# EasyEDA Pro project ProPrj_ch32v305_pico.epro, board 40low_CH32V305_RightWing
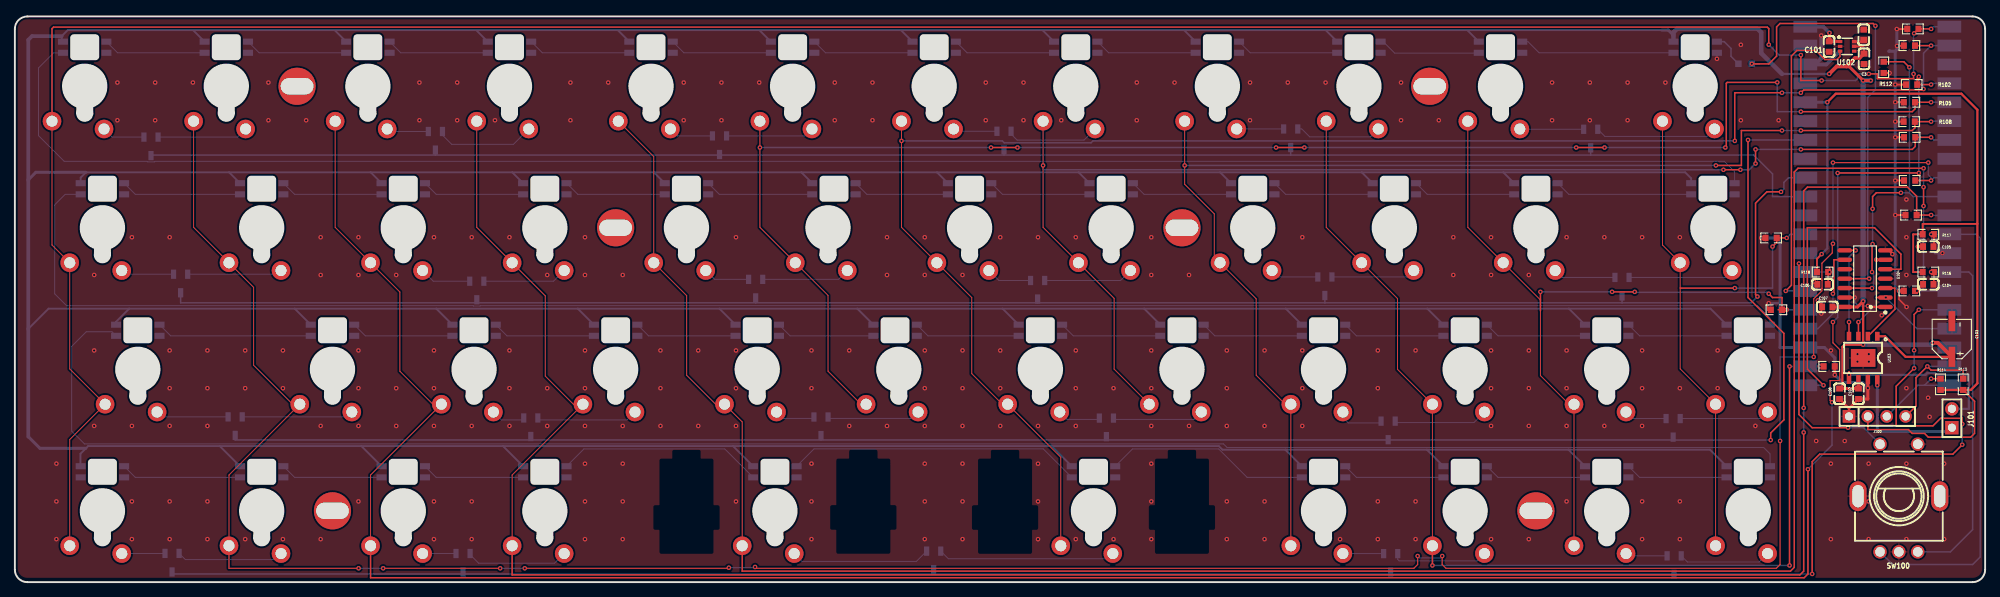
[diagram p5: board, top side]
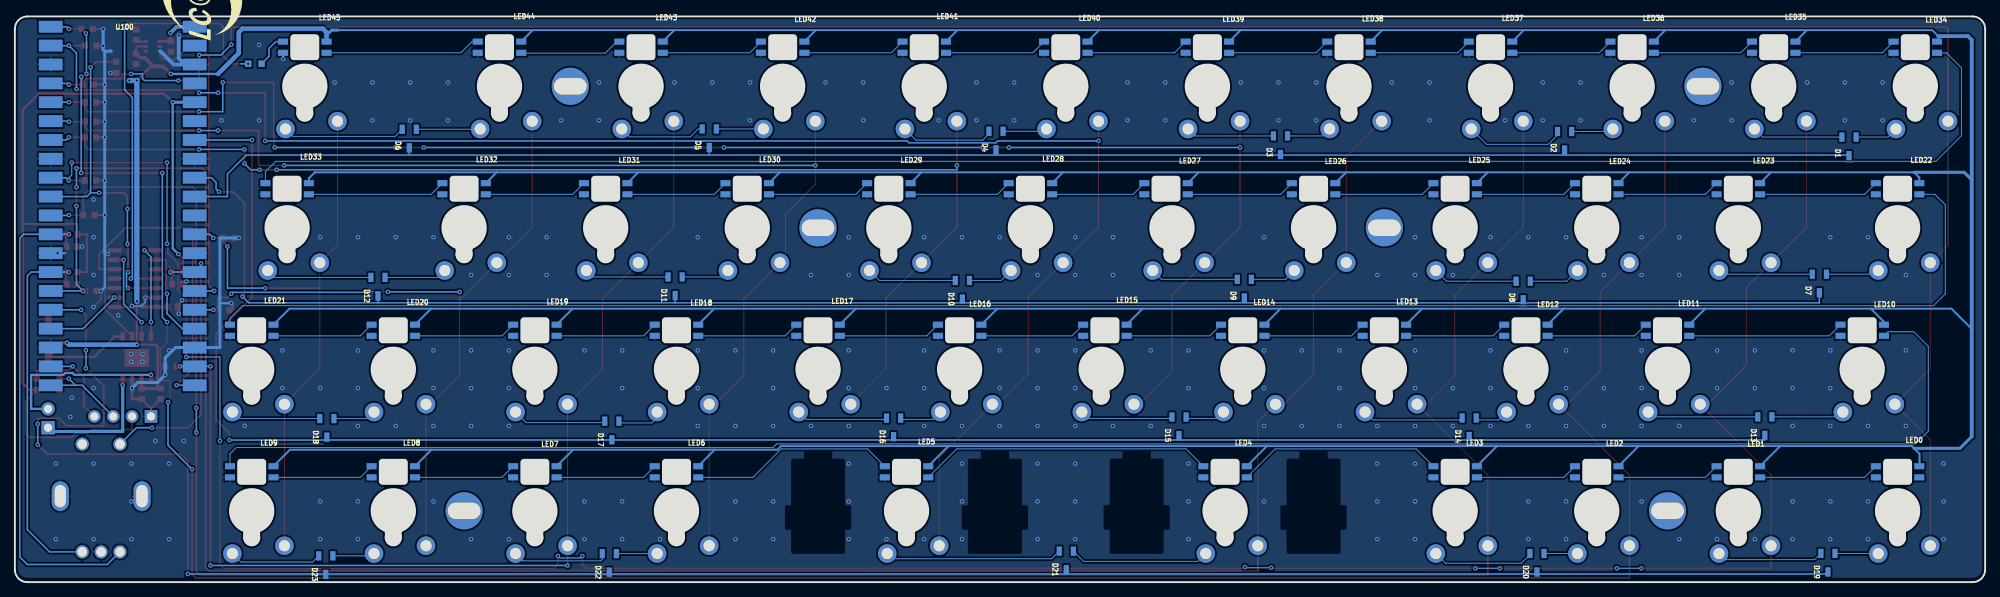
[diagram p6: board, bottom side, seen from below]

Outline 265.1 x 76.15 mm; copper layers: Top Layer, Bottom Layer. Coordinates in mm from the lower left corner of the outline.
Outline path: 0,74.47 0,1.68 arc(0.49,0.49) 1.68,0 263.43,0 arc(264.61,0.49) 265.1,1.68 265.1,74.47 arc(264.61,75.66) 263.43,76.15 1.68,76.15 arc(0.49,75.66) 0,74.47
Stack: Top Layer 0.035mm / Dielectric1 1.51mm FR4 er 4.5 / Bottom Layer 0.035mm

## Design rules (mm)
spacing Default (default): track to track 0.102, other pairs 0 to 0.3
track width Default (default): min 0.127, default 0.127, max 25.4
track width power: min 0.127, default 0.254, max 2.54
differential pair differentialPair (default): width min 0.127, default 2.54, max 2.54; gap min 0.127, default 0.152
net GND uses copperRegion
net VCC uses copperRegion, power
net 3V3 uses power
net VBUS_RAW uses power

## Placement (name value [footprint] x y rotation side)
C3  470nF  [C0603]  248.81 70.44 270 top
C100  100nF  [C0603]  248.77 73.68 90 top
C101  1uF  [C0603]  244.11 72.09 90 top
C102  100nF  [C0603]  248.06 25.36 270 top
C103  100uF  [CAP-SMD_BD5.0-L5.3-W5.3-LS6.3-FD]  260.63 32.72 90 top
C104  10nF  [C0603]  257.45 40.09 0 top
C105  10nF  [C0603]  257.45 45.17 0 top
C106  10nF  [C0603]  243.23 40.09 0 top
C107  100nF  [C0603]  243.87 37.04 180 top
C108  1uF  [C0603]  245.52 25.36 270 top
D1  BAT54A,215  [SOT-23-3]  18.32 58.66 90 bottom
D2  BAT54A,215  [SOT-23-3]  56.58 59.41 90 bottom
D3  BAT54A,215  [SOT-23-3]  94.81 58.82 90 bottom
D4  BAT54A,215  [SOT-23-3]  133.09 59.44 90 bottom
D5  BAT54A,215  [SOT-23-3]  171.67 59.75 90 bottom
D6  BAT54A,215  [SOT-23-3]  212.03 59.71 90 bottom
D7  BAT54A,215  [SOT-23-3]  22.3 40.2 90 bottom
D8  BAT54A,215  [SOT-23-3]  62.16 39.26 90 bottom
D9  BAT54A,215  [SOT-23-3]  99.67 39.51 90 bottom
D10  BAT54A,215  [SOT-23-3]  137.62 39.36 90 bottom
D11  BAT54A,215  [SOT-23-3]  176.26 39.83 90 bottom
D12  BAT54A,215  [SOT-23-3]  216.25 39.77 90 bottom
D13  BAT54A,215  [SOT-23-3]  29.64 21 90 bottom
D14  BAT54A,215  [SOT-23-3]  69.42 20.85 90 bottom
D15  BAT54A,215  [SOT-23-3]  108.47 20.98 90 bottom
D16  BAT54A,215  [SOT-23-3]  146.87 20.83 90 bottom
D17  BAT54A,215  [SOT-23-3]  184.78 20.42 90 bottom
D18  BAT54A,215  [SOT-23-3]  223.12 20.77 90 bottom
D19  BAT54A,215  [SOT-23-3]  21.15 2.62 90 bottom
D20  BAT54A,215  [SOT-23-3]  60.3 2.61 90 bottom
D21  BAT54A,215  [SOT-23-3]  123.63 2.93 90 bottom
D22  BAT54A,215  [SOT-23-3]  185.12 2.59 90 bottom
D23  BAT54A,215  [SOT-23-3]  223.26 2.29 90 bottom
J100  B-2100S04P-A110  [HDR-TH_4P-P2.54-V-M]  250.6 22.31 0 top
J101  SPEAKER 8R  [HDR-TH_2P-P2.54-V-M-1]  260.63 22.06 90 top
LED0  SK6812MINI-E-012  [reverse-led-candidate]  11.78 14.85 0 bottom
LED1  SK6812MINI-E-012  [reverse-led-candidate]  33.21 14.85 0 bottom
LED2  SK6812MINI-E-012  [reverse-led-candidate]  52.26 14.85 0 bottom
LED3  SK6812MINI-E-012  [reverse-led-candidate]  71.31 14.85 0 bottom
LED4  SK6812MINI-E-012  [reverse-led-candidate]  102.27 14.85 0 bottom
LED5  SK6812MINI-E-012  [reverse-led-candidate]  145.13 14.85 0 bottom
LED6  SK6812MINI-E-012  [reverse-led-candidate]  176.09 14.85 0 bottom
LED7  SK6812MINI-E-012  [reverse-led-candidate]  195.14 14.85 0 bottom
LED8  SK6812MINI-E-012  [reverse-led-candidate]  214.19 14.85 0 bottom
LED9  SK6812MINI-E-012  [reverse-led-candidate]  233.24 14.85 0 bottom
LED10  SK6812MINI-E-012  [reverse-led-candidate]  16.54 33.9 0 bottom
LED11  SK6812MINI-E-012  [reverse-led-candidate]  42.74 33.9 0 bottom
LED12  SK6812MINI-E-012  [reverse-led-candidate]  61.79 33.9 0 bottom
LED13  SK6812MINI-E-012  [reverse-led-candidate]  80.84 33.9 0 bottom
LED14  SK6812MINI-E-012  [reverse-led-candidate]  99.89 33.9 0 bottom
LED15  SK6812MINI-E-012  [reverse-led-candidate]  118.44 33.9 0 bottom
LED16  SK6812MINI-E-012  [reverse-led-candidate]  137.99 33.9 0 bottom
LED17  SK6812MINI-E-012  [reverse-led-candidate]  157.04 33.9 0 bottom
LED18  SK6812MINI-E-012  [reverse-led-candidate]  176.09 33.9 0 bottom
LED19  SK6812MINI-E-012  [reverse-led-candidate]  195.14 33.9 0 bottom
LED20  SK6812MINI-E-012  [reverse-led-candidate]  214.19 33.9 0 bottom
LED21  SK6812MINI-E-012  [reverse-led-candidate]  233.24 33.9 0 bottom
LED22  SK6812MINI-E-012  [reverse-led-candidate]  11.78 52.95 0 bottom
LED23  SK6812MINI-E-012  [reverse-led-candidate]  33.21 52.95 0 bottom
LED24  SK6812MINI-E-012  [reverse-led-candidate]  52.26 52.95 0 bottom
LED25  SK6812MINI-E-012  [reverse-led-candidate]  71.31 52.95 0 bottom
LED26  SK6812MINI-E-012  [reverse-led-candidate]  90.36 52.95 0 bottom
LED27  SK6812MINI-E-012  [reverse-led-candidate]  110.21 52.95 0 bottom
LED28  SK6812MINI-E-012  [reverse-led-candidate]  128.46 52.95 0 bottom
LED29  SK6812MINI-E-012  [reverse-led-candidate]  147.51 52.95 0 bottom
LED30  SK6812MINI-E-012  [reverse-led-candidate]  166.56 52.95 0 bottom
LED31  SK6812MINI-E-012  [reverse-led-candidate]  185.61 52.95 0 bottom
LED32  SK6812MINI-E-012  [reverse-led-candidate]  204.66 52.95 0 bottom
LED33  SK6812MINI-E-012  [reverse-led-candidate]  228.47 52.95 0 bottom
LED34  SK6812MINI-E-012  [reverse-led-candidate]  9.4 72 0 bottom
LED35  SK6812MINI-E-012  [reverse-led-candidate]  28.45 72 0 bottom
LED36  SK6812MINI-E-012  [reverse-led-candidate]  47.5 72 0 bottom
LED37  SK6812MINI-E-012  [reverse-led-candidate]  66.55 72 0 bottom
LED38  SK6812MINI-E-012  [reverse-led-candidate]  85.6 72 0 bottom
LED39  SK6812MINI-E-012  [reverse-led-candidate]  104.65 72 0 bottom
LED40  SK6812MINI-E-012  [reverse-led-candidate]  123.7 72 0 bottom
LED41  SK6812MINI-E-012  [reverse-led-candidate]  142.75 72 0 bottom
LED42  SK6812MINI-E-012  [reverse-led-candidate]  161.8 72 0 bottom
LED43  SK6812MINI-E-012  [reverse-led-candidate]  180.85 72 0 bottom
LED44  SK6812MINI-E-012  [reverse-led-candidate]  199.9 72 0 bottom
LED45  SK6812MINI-E-012  [reverse-led-candidate]  226.09 72 0 bottom
NOREF  -  [Pad_e1]  42.74 9.6 0 top
NOREF#2  -  [Pad_e4]  37.97 66.75 0 top
NOREF#3  -  [Pad_e5]  157.04 47.7 0 top
NOREF#4  -  [Pad_e3]  204.66 9.6 0 top
NOREF#5  -  [Pad_e2]  80.84 47.7 0 top
NOREF#6  -  [Pad_e6]  190.37 66.75 0 top
R100  10kΩ  [R0603]  255.38 74.47 180 top
R101  10kΩ  [R0603]  254.95 54.06 180 top
R102  10kΩ  [R0603]  255.22 66.98 180 top
R103  10kΩ  [R0603]  255.14 49.41 180 top
R104  10kΩ  [R0603]  254.91 39.2 180 top
R105  10kΩ  [R0603]  254.91 64.6 180 top
R106  10kΩ  [R0603]  254.91 72.22 180 top
R107  10kΩ  [R0603]  254.95 59.88 180 top
R108  10kΩ  [R0603]  254.89 61.99 180 top
R109  10kΩ  [R0603]  244.12 29.04 0 top
R110  10kΩ  [R0603]  237.02 36.66 180 top
R111  10kΩ  [R0603]  236.31 46.33 180 top
R112  10kΩ  [R0603]  251.46 69.29 270 top
R113  33R  [0603]  232.81 69.78 180 bottom
R114  4.7kΩ  [R0603]  259.11 26.63 270 top
R115  4.7kΩ  [R0603]  262.15 26.63 270 top
R116  10kΩ  [R0603]  257.45 41.74 0 top
R117  10kΩ  [R0603]  257.45 46.82 180 top
R118  10kΩ  [R0603]  243.23 41.74 180 top
S1  Gateron KS-33  [40low_KS33_Solder_KeepCentre6p1]  9.4 66.75 0 top
S2  Gateron KS-33  [40low_KS33_Solder_KeepCentre6p1]  28.45 66.75 0 top
S3  Gateron KS-33  [40low_KS33_Solder_KeepCentre6p1]  47.5 66.75 0 top
S4  Gateron KS-33  [40low_KS33_Solder_KeepCentre6p1]  66.55 66.75 0 top
S5  Gateron KS-33  [40low_KS33_Solder_KeepCentre6p1]  85.6 66.75 0 top
S6  Gateron KS-33  [40low_KS33_Solder_KeepCentre6p1]  104.65 66.75 0 top
S7  Gateron KS-33  [40low_KS33_Solder_KeepCentre6p1]  123.7 66.75 0 top
S8  Gateron KS-33  [40low_KS33_Solder_KeepCentre6p1]  142.75 66.75 0 top
S9  Gateron KS-33  [40low_KS33_Solder_KeepCentre6p1]  161.8 66.75 0 top
S10  Gateron KS-33  [40low_KS33_Solder_KeepCentre6p1]  180.85 66.75 0 top
S11  Gateron KS-33  [40low_KS33_Solder_KeepCentre6p1]  199.9 66.75 0 top
S12  Gateron KS-33  [40low_KS33_Solder_KeepCentre6p1]  226.09 66.75 0 top
S13  Gateron KS-33  [40low_KS33_Solder_KeepCentre6p1]  11.78 47.7 0 top
S14  Gateron KS-33  [40low_KS33_Solder_KeepCentre6p1]  33.21 47.7 0 top
S15  Gateron KS-33  [40low_KS33_Solder_KeepCentre6p1]  52.26 47.7 0 top
S16  Gateron KS-33  [40low_KS33_Solder_KeepCentre6p1]  71.31 47.7 0 top
S17  Gateron KS-33  [40low_KS33_Solder_KeepCentre6p1]  90.36 47.7 0 top
S18  Gateron KS-33  [40low_KS33_Solder_KeepCentre6p1]  109.41 47.7 0 top
S19  Gateron KS-33  [40low_KS33_Solder_KeepCentre6p1]  128.46 47.7 0 top
S20  Gateron KS-33  [40low_KS33_Solder_KeepCentre6p1]  147.51 47.7 0 top
S21  Gateron KS-33  [40low_KS33_Solder_KeepCentre6p1]  166.56 47.7 0 top
S22  Gateron KS-33  [40low_KS33_Solder_KeepCentre6p1]  185.61 47.7 0 top
S23  Gateron KS-33  [40low_KS33_Solder_KeepCentre6p1]  204.66 47.7 0 top
S24  Gateron KS-33  [40low_KS33_Solder_KeepCentre6p1]  228.47 47.7 0 top
S25  Gateron KS-33  [40low_KS33_Solder_KeepCentre6p1]  16.54 28.65 0 top
S26  Gateron KS-33  [40low_KS33_Solder_KeepCentre6p1]  42.74 28.65 0 top
S27  Gateron KS-33  [40low_KS33_Solder_KeepCentre6p1]  61.79 28.65 0 top
S28  Gateron KS-33  [40low_KS33_Solder_KeepCentre6p1]  80.84 28.65 0 top
S29  Gateron KS-33  [40low_KS33_Solder_KeepCentre6p1]  99.89 28.65 0 top
S30  Gateron KS-33  [40low_KS33_Solder_KeepCentre6p1]  118.94 28.65 0 top
S31  Gateron KS-33  [40low_KS33_Solder_KeepCentre6p1]  137.99 28.65 0 top
S32  Gateron KS-33  [40low_KS33_Solder_KeepCentre6p1]  157.04 28.65 0 top
S33  Gateron KS-33  [40low_KS33_Solder_KeepCentre6p1]  176.09 28.65 0 top
S34  Gateron KS-33  [40low_KS33_Solder_KeepCentre6p1]  195.14 28.65 0 top
S35  Gateron KS-33  [40low_KS33_Solder_KeepCentre6p1]  214.19 28.65 0 top
S36  Gateron KS-33  [40low_KS33_Solder_KeepCentre6p1]  233.24 28.65 0 top
S37  Gateron KS-33  [40low_KS33_Solder_KeepCentre6p1]  11.78 9.6 0 top
S38  Gateron KS-33  [40low_KS33_Solder_KeepCentre6p1]  33.21 9.6 0 top
S39  Gateron KS-33  [40low_KS33_Solder_KeepCentre6p1]  52.26 9.6 0 top
S40  Gateron KS-33  [40low_KS33_Solder_KeepCentre6p1]  71.31 9.6 0 top
S41  Gateron KS-33  [40low_KS33_Solder_KeepCentre6p1]  102.27 9.6 0 top
S42  Gateron KS-33  [40low_KS33_Solder_KeepCentre6p1]  145.13 9.6 0 top
S43  Gateron KS-33  [40low_KS33_Solder_KeepCentre6p1]  176.09 9.6 0 top
S44  Gateron KS-33  [40low_KS33_Solder_KeepCentre6p1]  195.14 9.6 0 top
S45  Gateron KS-33  [40low_KS33_Solder_KeepCentre6p1]  214.19 9.6 0 top
S46  Gateron KS-33  [40low_KS33_Solder_KeepCentre6p1]  233.24 9.6 0 top
SW100  EC11E15244G1  [SW-TH_EC11E15244G1]  253.5 11.33 0 top
U100  CH32V305 Pico  [CH32V305_Pico_Castellated_40]  250.6 50.63 180 bottom
U102  TPS22919DCKR  [SC-70-6_L2.2-W1.3-P0.65-LS2.1-BR]  246.54 72.12 180 top
U103  NS4168  [ESOP-8_L4.9-W3.9-P1.27-LS6.0-BL-EP]  248.69 30.18 180 top
U104  74AHCT125D,118  [SOP-14_L8.6-W3.9-P1.27-LS6.0-BL]  248.95 40.85 90 top

## Footprints (pads in the part's own frame, mm; a bottom-side part is the same pattern mirrored in y, then rotated)
40low_KS33_Solder_KeepCentre6p1
  round 2.5 hole 1.5: 1(-4.4,-4.7) 2(2.6,-5.75)
0603
  rect 0.88x0.88 smd: 1(-0.9,0) 2(0.9,0)
C0603
  rect 0.8x0.9 smd: 1(-0.7,0) 2(0.7,0)
CAP-SMD_BD5.0-L5.3-W5.3-LS6.3-FD
  rect 2.7x0.91 smd: 1(-2.4,0) 2(2.4,0)
CH32V305_Pico_Castellated_40
  rect 3.2x1.6 smd: 1(-9.69,24.13) 2(-9.69,21.59) 3(-9.69,19.05) 4(-9.69,16.51) 5(-9.69,13.97) 6(-9.69,11.43) 7(-9.69,8.89) 8(-9.69,6.35) 9(-9.69,3.81) 10(-9.69,1.27) 11(-9.69,-1.27) 12(-9.69,-3.81) 13(-9.69,-6.35) 14(-9.69,-8.89) 15(-9.69,-11.43) 16(-9.69,-13.97) 17(-9.69,-16.51) 18(-9.69,-19.05) 19(-9.69,-21.59) 20(-9.69,-24.13) 21(9.69,-24.13) 22(9.69,-21.59) 23(9.69,-19.05) 24(9.69,-16.51) 25(9.69,-13.97) 26(9.69,-11.43) 27(9.69,-8.89) 28(9.69,-6.35) 29(9.69,-3.81) 30(9.69,-1.27) 31(9.69,1.27) 32(9.69,3.81) 33(9.69,6.35) 34(9.69,8.89) 35(9.69,11.43) 36(9.69,13.97) 37(9.69,16.51) 38(9.69,19.05) 39(9.69,21.59) 40(9.69,24.13)
ESOP-8_L4.9-W3.9-P1.27-LS6.0-BL-EP
  rect 0.6x1.2 smd: 1(-1.905,-2.909) 2(-0.635,-2.909) 3(0.635,-2.909) 4(1.905,-2.909) 5(1.905,2.909) 6(0.635,2.909) 7(-0.635,2.909) 8(-1.905,2.909)
  rect 3.3x2.4 smd: 9(0,0)
HDR-TH_2P-P2.54-V-M-1
  rect 1.8x1.8 hole 1.1: 1(-1.27,0)
  round 1.8 hole 1.1: 2(1.27,0)
HDR-TH_4P-P2.54-V-M
  rect 1.7x1.7 hole 1.1: 1(-3.81,0)
  round 1.7 hole 1.1: 2(-1.27,0) 3(1.27,0) 4(3.81,0)
Pad_e1
  round 5 hole 4.4x2.2: 1(0,0)
Pad_e2
  round 5 hole 4.4x2.2: 1(0,0)
Pad_e3
  round 5 hole 4.4x2.2: 1(0,0)
Pad_e4
  round 5 hole 4.4x2.2: 1(0,0)
Pad_e5
  round 5 hole 4.4x2.2: 1(0,0)
Pad_e6
  round 5 hole 4.4x2.2: 1(0,0)
R0603
  rect 0.806x0.864 smd: 1(-0.753,0) 2(0.753,0)
reverse-led-candidate
  rect 1.35x0.82 smd: 1(2.925,0.75) 2(2.925,-0.75) 3(-2.925,-0.75) 4(-2.925,0.75)
SC-70-6_L2.2-W1.3-P0.65-LS2.1-BR
  rect 0.6x0.42 smd: 1(0.95,-0.65) 2(0.95,0) 3(0.95,0.65) 4(-0.95,0.65) 5(-0.95,0) 6(-0.95,-0.65)
SOP-14_L8.6-W3.9-P1.27-LS6.0-BL
  oval 0.595x1.968 smd: 1(-3.81,-2.734) 2(-2.54,-2.734) 3(-1.27,-2.734) 4(0,-2.734) 5(1.27,-2.734) 6(2.54,-2.734) 7(3.81,-2.734) 8(3.81,2.734) 9(2.54,2.734) 10(1.27,2.734) 11(0,2.734) 12(-1.27,2.734) 13(-2.54,2.734) 14(-3.81,2.734)
SOT-23-3
  rect 1.25x0.7 smd: 1(1.25,-0.95) 2(1.25,0.95) 3(-1.25,0)
SW-TH_EC11E15244G1
  oval 2.3x4 hole 1.5x3: 6(5.5,0.25) 7(-5.5,0.25)
  round 1.8 hole 1.3: A(-2.54,-7.25) B(2.54,-7.25) C(0,-7.25) D(-2.54,7.25) E(2.54,7.25)

## Nets
As in the schematic.

Pads without a net: LED0 4; NOREF 1; NOREF#2 1; NOREF#3 1; NOREF#4 1; NOREF#5 1; NOREF#6 1; U100 30 35 37 39; U102 4

## Via types
v1: diameter 0.61, hole 0.305, Top Layer to Bottom Layer, 404 vias

## Routing (per net, layer and track width the routed paths; a pad name or vN(x,y) marks a point on that pad's centre or on a via; arc(x,y) is an arc through that point)
3V3: length 129.7
  Top Layer w0.203: J100.2 249.33,20.53 254.79,20.53 255.3,20.02 256.95,20.02 257.45,19.52 263.17,19.52 263.68,20.02 263.68,24.35 R115.2
  Top Layer w0.254: v1(243.1,44.15) 242.48,43.53 242.48,41.74 ; 264.06,48.22 256.7,48.22 256.7,46.82 255.42,46.82 255.42,41.74 256.7,41.74
  Top Layer w0.305: v1(243.87,64.6) 245.01,65.74 261.9,65.74 264.06,63.59 264.06,26.76 263.18,25.87 R115.2 R114.2
  Bottom Layer w0.305: v1(243.1,44.15) 243.87,44.92 v1(243.87,64.6)
  Bottom Layer w0.406: U100.36 v1(243.87,64.6)
GND: length 120
  Top Layer w0.203: v1(252.63,44.15) 252.12,44.66 U104.7 ; v1(254.53,37.04) 253.52,38.06 v1(253.52,39.2) ; 243.06,37.04 v1(243.06,36.15) ; U104.13 v1(247.55,38.31)
  Top Layer w0.254: v1(242.04,40.47) 242.42,40.09 242.53,40.09 ; 254.14,61.99 v1(253.01,61.99) ; v1(242.6,37.93) 243.16,37.36 243.16,37.04 ; R107.2 v1(253.01,59.88) ; R102.2 v1(253.01,66.98) ; R103.2 v1(253.01,49.41) ; R112.2 v1(252.25,68.54) ; 254.2,54.07 v1(253.01,54.07) ; 254.16,72.22 254.12,72.18 v1(253.25,72.18) ; 254.16,39.2 v1(253.52,39.2) ; 254.16,64.6 v1(253.01,64.6) ; 236.27,36.66 235.76,36.66 ; 254.63,74.47 254.61,74.45 v1(253.23,74.45)
  Top Layer w0.305: C108.2 246.79,23.39 ; 246.79,23.39 C102.2 ; 246.79,23.39 J100.1 ; v1(249.33,37.17) 249.45,37.04 U104.1 ; v1(235.99,37.55) 235.76,37.32 235.76,36.66 ; 235.55,46.33 v1(234.98,46.33) ; 256.75,45.17 v1(256.06,45.17) ; R109.2 v1(244.87,27.9)
  Top Layer w0.406: U103.7 249.33,24.66 C102.2
  Bottom Layer w0.203: v1(252.63,44.15) 253.01,44.15 ; v1(247.55,38.31) 247.55,37.68 248.06,37.17 v1(249.33,37.17)
  Bottom Layer w0.305: 229.02,71.25 v1(229.02,70.44) ; 258.34,44.28 v1(259.36,44.28) U100.13 ; 253.01,44.15 253.01,39.71 v1(253.52,39.2) ; v1(235.99,37.55) 237.52,37.55
  Bottom Layer w0.406: 252.24,71.55 252.15,71.46 253.01,71.46 ; 253.01,71.46 v1(253.01,66.98) v1(253.01,64.6) v1(253.01,61.99) v1(253.01,59.88) v1(253.01,54.07) v1(253.01,49.41) 253.01,44.15 ; 253.01,71.46 253.25,71.7 v1(253.25,72.18) 253.23,72.21 v1(253.23,74.45) ; v1(234.98,46.33) 237.52,46.33 237.52,31.58 U100.23 243.48,31.58 244.87,30.19 v1(244.87,27.9) 245.9,26.88 248.57,26.88 v1(249.33,26.12)
  Bottom Layer w0.508: 242.23,69.68 243.74,69.68 245.52,71.46 ; 242.23,69.68 U100.38 ; 242.23,69.68 243.05,70.51 v1(243.05,73.58)
  vias: v1(5.59,15.95) v1(5.59,10.87) v1(5.59,5.79) v1(10.67,41.35) v1(10.67,31.19) v1(10.67,21.03) v1(13.79,67.25) v1(13.79,62.17) v1(15.75,46.43) v1(15.75,21.03) v1(15.75,10.87) v1(15.75,5.79) v1(18.88,67.25) v1(18.88,62.17) v1(20.83,46.43) v1(20.83,31.19) v1(20.83,26.11) v1(20.83,21.03) v1(20.83,10.87) v1(20.83,5.79) v1(23.95,67.25) v1(25.91,31.19) v1(25.91,26.11) v1(25.91,21.03) v1(25.91,10.87) v1(25.91,5.79) v1(30.99,31.19) v1(30.99,26.11) v1(30.99,5.79) v1(34.12,67.25) v1(34.12,62.17) v1(36.07,31.19) v1(36.07,26.11) v1(36.07,5.79) v1(39.2,62.17) v1(41.15,46.43) v1(41.15,41.35) v1(41.15,21.03) v1(41.15,5.79) v1(46.23,46.43) v1(46.23,41.35) v1(46.23,31.19) v1(46.23,26.11) v1(46.23,21.03) v1(46.23,10.87) v1(51.31,41.35) v1(51.31,26.11) v1(51.31,21.03) v1(54.44,67.25) v1(54.44,62.17) v1(56.39,46.43) v1(56.39,31.19) v1(56.39,26.11) v1(56.39,21.03) v1(56.39,10.87) v1(56.39,5.79) v1(59.52,67.25) v1(59.52,62.17) v1(61.47,46.43) v1(61.47,21.03) v1(61.47,10.87) v1(61.47,5.79) v1(64.59,62.17) v1(66.55,46.43) v1(66.55,31.19) v1(66.55,26.11) v1(66.55,21.03) v1(71.63,41.35) v1(71.63,26.11) v1(71.63,21.03) v1(74.75,67.25) v1(74.75,62.17) v1(76.71,46.43) v1(76.71,41.35) v1(76.71,31.19) v1(76.71,26.11) v1(76.71,21.03) v1(76.71,15.95) v1(76.71,10.87) v1(76.71,5.79) v1(79.83,67.25) v1(81.79,41.35) v1(81.79,21.03) v1(81.79,15.95) v1(81.79,10.87) v1(81.79,5.79) v1(86.87,31.19) v1(86.87,26.11) v1(86.87,21.03) v1(90,67.25) v1(90,62.17) v1(91.95,31.19) v1(91.95,21.03) v1(95.08,67.25) v1(95.08,62.17) v1(97.03,46.43) v1(97.03,31.19) v1(97.03,26.11) v1(97.03,21.03) v1(97.03,10.87) v1(100.16,67.25) v1(107.19,31.19) v1(107.19,26.11) v1(107.19,15.95) v1(107.19,10.87) v1(107.19,5.79) v1(110.31,67.25) v1(110.31,62.17) v1(112.27,31.19) v1(112.27,21.03) v1(115.4,67.25) v1(115.4,62.17) v1(117.35,46.43) v1(117.35,41.35) v1(117.35,21.03) v1(122.43,46.43) v1(122.43,41.35) v1(122.43,31.19) v1(122.43,26.11) v1(122.43,21.03) v1(122.43,15.95) v1(122.43,10.87) v1(122.43,5.79) v1(127.51,41.35) v1(127.51,31.19) v1(127.51,26.11) v1(127.51,21.03) v1(127.51,15.95) v1(127.51,10.87) v1(127.51,5.79) v1(130.63,67.25) v1(130.63,62.17) v1(132.59,46.43) v1(132.59,31.19) v1(132.59,26.11) v1(132.59,21.03) v1(135.72,67.25) v1(135.72,62.17) v1(137.67,46.43) v1(137.67,21.03) v1(137.67,15.95) v1(137.67,10.87) v1(137.67,5.79) v1(140.79,62.17) v1(142.75,46.43) v1(142.75,31.19) v1(142.75,26.11) v1(142.75,21.03) v1(142.75,5.79) v1(147.83,26.11) v1(147.83,5.79) v1(150.96,67.25) v1(150.96,62.17) v1(152.91,46.43) v1(152.91,41.35) v1(152.91,31.19) v1(152.91,26.11) v1(152.91,21.03) v1(152.91,15.95) v1(152.91,10.87) v1(152.91,5.79) v1(156.03,67.25) v1(157.99,41.35) v1(157.99,21.03) v1(163.07,31.19) v1(163.07,26.11) v1(163.07,21.03) v1(163.07,10.87) v1(163.07,5.79) v1(166.19,67.25) v1(166.19,62.17) v1(168.15,31.19) v1(168.15,21.03) v1(168.15,10.87) v1(168.15,5.79) v1(171.28,67.25) v1(173.23,46.43) v1(173.23,31.19) v1(173.23,26.11) v1(173.23,21.03) v1(176.35,67.25) v1(178.31,5.79) v1(183.39,31.19) v1(183.39,26.11) v1(183.39,10.87) v1(183.39,5.79) v1(186.51,67.25) v1(186.51,62.17) v1(188.47,31.19) v1(188.47,10.87) v1(188.47,5.79) v1(191.59,62.17) v1(193.55,46.43) v1(193.55,41.35) v1(198.63,46.43) v1(198.63,41.35) v1(198.63,31.19) v1(198.63,26.11) v1(198.63,21.03) v1(198.63,5.79) v1(203.71,41.35) v1(203.71,31.19) v1(203.71,26.11) v1(203.71,21.03) v1(203.71,5.79) v1(206.84,67.25) v1(206.84,62.17) v1(208.79,46.43) v1(208.79,31.19) v1(208.79,26.11) v1(208.79,21.03) v1(208.79,10.87) v1(211.91,67.25) v1(211.91,62.17) v1(213.87,46.43) v1(213.87,21.03) v1(217,67.25) v1(217,62.17) v1(218.95,46.43) v1(218.95,31.19) v1(218.95,26.11) v1(218.95,21.03) v1(218.95,10.87) v1(218.95,5.79) v1(222.07,67.25) v1(224.03,46.43) v1(224.03,26.11) v1(224.03,10.87) v1(224.03,5.79) v1(229.11,31.19) v1(229.11,26.11) v1(232.23,72.33) v1(232.23,62.17) v1(234.19,21.03) v1(237.31,62.17) v1(242.37,19) v1(244.35,31.19) v1(244.35,15.95) v1(244.35,5.79) v1(246.21,19) v1(247.93,30.69) v1(247.93,29.68) v1(249.45,30.69) v1(249.45,29.68) v1(249.43,15.95) v1(249.43,10.87) v1(249.43,5.79) v1(251.19,35.92) v1(254.51,51.51) v1(254.51,46.43) v1(254.51,41.35) v1(254.51,26.11) v1(254.51,15.95) v1(254.51,5.79) v1(257.43,24.83) v1(257.64,22.25) v1(259.59,15.95) v1(259.59,5.79)
VBUS_RAW: length 6.2
  Top Layer w0.406: v1(244.16,73.93) 244.14,73.91 244.14,72.82 C101.2 245.56,72.79 U102.1
  Bottom Layer w0.508: v1(244.16,73.93) 243.33,74.76 U100.40
VCC: length 1189.1
  Top Layer w0.254: U102.6 248.56,72.77 C100.1 ; U102.5 248.6,72.12 248.81,71.92 C3.1
  Top Layer w0.305: C103.1 254.41,30.32 251.64,33.09 U103.1 ; v1(248.69,37.8) v1(248.69,31.96) 246.2,31.96 245.9,31.66 245.9,26.44 C108.1
  Top Layer w0.406: C108.1 C102.1 U103.6 ; 246.79,69.43 v1(248.69,67.52) v1(249.71,67.52) ; 244.57,37.04 U104.14 247.93,37.04 v1(248.69,37.8)
  Top Layer w0.457: 246.44,69.43 247.59,70.57 248.23,70.57 C3.1
  Top Layer w0.508: v1(244.12,68.41) 245.14,69.43 246.79,69.43 ; C103.1 258.74,32.22 v1(258.09,32.22)
  Bottom Layer w0.254: LED17.3 151.95,36.81 ; 151.95,36.81 132.9,36.81 ; 151.95,36.81 171,36.81 ; LED36.3 43.02,74.31 ; 43.02,74.31 62.07,74.31 ; 43.02,74.31 23.97,74.31 ; LED33.3 225.55,54.36 224.74,55.17 200.27,55.17 ; LED9.3 228.09,17.83 209.04,17.83 ; 119.22,74.31 100.17,74.31 ; 119.22,74.31 138.27,74.31 ; 119.22,74.31 LED40.3 ; 100.17,74.31 81.12,74.31 ; 100.17,74.31 LED39.3 ; 132.9,36.81 113.35,36.81 ; 132.9,36.81 LED16.3 ; 113.35,36.81 115.51,34.65 ; 113.35,36.81 94.8,36.81 ; 162.17,55.17 143.12,55.17 ; 162.17,55.17 181.22,55.17 ; 162.17,55.17 LED30.3 ; 143.12,55.17 124.07,55.17 ; 143.12,55.17 LED29.3 ; 190.05,36.81 171,36.81 ; 190.05,36.81 LED19.3 ; 190.05,36.81 209.1,36.81 ; 171,36.81 LED18.3 ; LED7.3 189.99,17.83 ; 189.99,17.83 170.94,17.83 ; 189.99,17.83 209.04,17.83 ; 170.94,17.83 LED6.3 ; 170.94,17.83 162.48,17.83 162,18.32 139.49,18.32 ; 176.37,74.31 157.32,74.31 ; 176.37,74.31 195.42,74.31 ; 176.37,74.31 LED43.3 ; 157.32,74.31 138.27,74.31 ; 157.32,74.31 LED42.3 ; LED44.3 195.42,74.31 ; 195.42,74.31 221.61,74.31 ; 62.07,74.31 81.12,74.31 ; 62.07,74.31 LED37.3 ; LED5.3 139.49,18.32 ; 139.49,18.32 96.63,18.32 ; LED11.3 37.65,36.81 ; 37.65,36.81 56.7,36.81 ; 37.65,36.81 15.38,36.81 ; LED8.3 209.04,17.83 ; 56.7,36.81 LED12.3 ; 56.7,36.81 75.75,36.81 ; LED1.3 27.57,18.32 ; 27.57,18.32 9.86,18.32 9.56,18.01 8.83,17.28 8.83,15.63 LED0.3 ; 27.57,18.32 46.62,18.32 ; LED38.3 81.12,74.31 ; LED28.3 124.07,55.17 ; 124.07,55.17 105.82,55.17 ; LED24.3 47.87,55.17 ; 47.87,55.17 66.92,55.17 ; 47.87,55.17 28.82,55.17 ; 65.67,18.32 46.62,18.32 ; 65.67,18.32 LED3.3 ; 65.67,18.32 96.63,18.32 ; 46.62,18.32 LED2.3 ; 66.92,55.17 85.97,55.17 ; 66.92,55.17 LED25.3 ; 138.27,74.31 LED41.3 ; 15.38,36.81 13.62,35.05 LED10.3 ; 15.38,36.81 4.53,36.81 1.8,34.09 ; LED13.3 75.75,36.81 ; 75.75,36.81 94.8,36.81 ; 181.22,55.17 LED31.3 ; 181.22,55.17 200.27,55.17 ; LED22.3 8.85,54.45 9.57,55.17 28.82,55.17 ; LED32.3 200.27,55.17 ; 105.82,55.17 85.97,55.17 ; 105.82,55.17 LED27.3 ; 85.97,55.17 LED26.3 ; 23.97,74.31 LED35.3 ; 23.97,74.31 7.12,74.31 6.31,73.5 6.31,72.92 LED34.3 ; 96.63,18.32 LED4.3 ; 94.8,36.81 LED14.3 ; 209.1,36.81 228.15,36.81 LED21.3 ; 209.1,36.81 LED20.3 ; 28.82,55.17 LED23.3
  Bottom Layer w0.305: v1(244.12,68.41) 237.77,68.41
  Bottom Layer w0.406: 1.8,54.15 2.82,55.17 9.57,55.17 ; 221.61,74.31 222.47,74.31 223.17,73.62 ; 9.56,18.01 3.38,18.01 1.8,19.59
  Bottom Layer w0.508: 1.8,19.59 1.8,72.99 2.31,73.5 6.31,73.5
  Bottom Layer w0.61: LED45.3 223.17,74 223.68,74.51 234.47,74.51 234.98,74 234.98,71.21 237.77,68.41 ; v1(248.69,31.96) 257.84,31.96 v1(258.09,32.22)
  Bottom Layer w0.711: v1(249.71,67.52) v1(248.69,67.52) v1(248.69,37.8)
COL1: length 344
  Top Layer w0.127: S37.1 7.38,19.19 S25.1 7.38,28.71 S13.1 5,45.38 S1.1
  Top Layer w0.203: v1(243.1,67.52) 240.31,67.52 v1(240.31,70.95) ; v1(249.45,68.41) 250.6,68.41 250.6,67.78 255.47,67.78 v1(255.47,68.41) ; v1(235.99,72.35) 235.99,74.51 235.79,74.71 5.2,74.71 5,74.51 S1.1 ; v1(255.55,73.87) 255.55,73.88 256.14,74.47 v1(257.84,74.47)
  Bottom Layer w0.203: v1(240.31,70.95) 237.39,70.95 v1(235.99,72.35) ; v1(255.55,73.87) 255.47,73.8 v1(255.47,68.41) ; U100.1 258.13,74.76 v1(257.84,74.47) ; v1(243.1,67.52) 247.68,67.52 247.93,67.78 247.93,68.41 v1(249.45,68.41)
COL2: length 362.4
  Top Layer w0.127: S38.1 28.81,14.42 S26.1 37.37,23.95 32.12,29.19 32.12,39.68 S14.1 24.05,47.76 S2.1
  Top Layer w0.152: v1(188.75,3.51) 188.75,2.37 188.24,1.86 99.77,1.86 v1(99.59,2.04) ; v1(68.61,1.86) 95.99,1.86 v1(96.07,1.94) ; v1(242.04,30.31) 242.04,38.13 242.47,38.57 242.49,38.57 243.14,39.22 243.14,39.53 243.16,39.55 243.16,40.64 243.14,40.65 243.14,42.93 244.54,44.33 244.54,45.46 v1(244.63,45.55) ; S38.1 28.81,1.86 v1(46.25,1.86) ; v1(244.63,56.47) v1(257.45,56.47) ; v1(237.52,19.01) 237.52,2.37 237.01,1.86 192.56,1.86 192.05,2.37 v1(192.05,3.51) ; v1(49.56,1.86) v1(65.3,1.86)
  Top Layer w0.203: 255.7,54.07 v1(257.84,54.07)
  Bottom Layer w0.152: v1(192.05,3.51) 191.8,3.26 189,3.26 v1(188.75,3.51) ; v1(237.52,19.01) 237.52,30.31 v1(242.04,30.31) ; v1(257.84,54.07) 257.84,54.45 257.45,54.83 v1(257.45,56.47) ; v1(96.07,1.94) 99.49,1.94 v1(99.59,2.04) ; v1(244.63,45.55) v1(244.63,56.47) ; v1(65.3,1.86) v1(68.61,1.86) ; v1(46.25,1.86) v1(49.56,1.86)
  Bottom Layer w0.203: U100.9 258.21,54.44 v1(257.84,54.07)
COL3: length 352.4
  Top Layer w0.127: S39.1 47.86,14.42 S27.1 56.24,23.95 51.8,28.39 51.8,39.06 S15.1 43.1,47.76 S3.1
  Top Layer w0.152: v1(244.5,24.22) 244.25,24.47 244.25,27.14 245.54,27.14 245.54,31.3 244.63,32.22 v1(244.63,35.01)
  Top Layer w0.203: v1(256.18,68.03) 255.97,67.82 R102.1 v1(257.84,66.98) ; v1(241.26,15.2) 241.26,1.1 240.75,0.59 47.86,0.59 S39.1 ; v1(245.26,55.08) v1(256.18,55.08)
  Bottom Layer w0.203: U100.4 258,67.14 v1(257.84,66.98) ; v1(256.18,55.08) v1(256.18,68.03) ; v1(244.5,24.22) 244.5,18.44 v1(241.26,15.2) ; v1(245.26,55.08) 245.26,35.65 v1(244.63,35.01)
COL4: length 319.7
  Top Layer w0.127: S4.1 62.15,47.76 S16.1 71.37,38.54 71.37,27.73 75.15,23.95 S28.1 66.91,14.42 S40.1
  Top Layer w0.203: v1(257.84,49.41) R103.1 255.89,51.94 254.66,53.17 241.2,53.17 240.69,52.66 v1(240.69,23.45) ; S40.1 66.91,0.97 240.18,0.97 240.69,1.48 v1(240.69,20.15)
  Bottom Layer w0.203: v1(240.69,20.15) v1(240.69,23.45) ; U100.11 257.89,49.36 v1(257.84,49.41)
COL5: length 302.3
  Top Layer w0.127: S5.1 85.96,57.29 S17.1 90.39,38.57 90.39,27.84 94.29,23.95 S29.1 97.87,21.57 S41.1
  Top Layer w0.203: S41.1 97.87,1.48 238.91,1.48 239.42,1.99 239.42,55.2 239.93,55.71 v1(256.82,55.71) ; v1(256.82,53.17) v1(256.82,50.63) ; 255.67,39.2 v1(255.93,39.2)
  Bottom Layer w0.203: v1(256.82,50.63) 256.82,40.09 v1(255.93,39.2) U100.15 ; v1(256.82,55.71) v1(256.82,53.17)
COL6: length 218.1
  Top Layer w0.127: S30.1 113.86,23.95 109.42,28.39 109.42,38.59 S18.1 100.25,47.76 S6.1
  Top Layer w0.203: v1(169.7,58.51) v1(173.51,58.51) ; v1(131.34,58.51) v1(134.9,58.51) ; v1(210.08,58.51) v1(213.89,58.51) ; v1(237.13,67.27) 230.4,67.27 230.28,67.14 230.28,58.63 v1(230.15,58.51) ; v1(257.84,64.6) 255.67,64.6 255.67,63.71 255.3,63.33 v1(240.31,63.33)
  Bottom Layer w0.203: v1(257.84,64.6) U100.5 ; v1(213.89,58.51) v1(230.15,58.51) ; v1(100.25,58.51) v1(131.34,58.51) ; v1(173.51,58.51) v1(210.08,58.51) ; v1(237.13,67.27) 237.13,63.33 v1(240.31,63.33) ; v1(134.9,58.51) v1(169.7,58.51)
COL7: length 221.8
  Top Layer w0.127: S42.1 140.73,16.8 S31.1 132.87,23.95 128.75,28.06 128.75,38.31 S19.1 119.3,47.76 S7.1
  Top Layer w0.203: v1(231.42,59.39) 231.42,65.87 v1(237.77,65.87) ; v1(240.31,65.87) 240.69,66.25 256.82,66.25 v1(256.82,66.38) ; 255.67,72.22 v1(257.84,72.22)
  Bottom Layer w0.203: U100.2 v1(257.84,72.22) 256.82,71.21 v1(256.82,66.38) ; v1(119.3,59.39) 132.87,59.39 133.12,59.14 144.81,59.14 145.06,59.39 v1(231.42,59.39) ; v1(237.77,65.87) v1(240.31,65.87)
COL8: length 170.3
  Top Layer w0.127: S32.1 147.9,28.68 147.9,38.2 S20.1 138.35,47.76 S8.1
  Top Layer w0.203: v1(240.31,58.25) 255.3,58.25 255.7,58.66 R107.1 v1(257.84,59.88) ; v1(234.21,56.35) v1(234.21,58.25) ; v1(229.9,55.51) v1(232.18,55.51)
  Bottom Layer w0.203: v1(257.84,59.88) 258.19,59.52 U100.7 ; v1(234.21,56.35) 233.38,55.51 v1(232.18,55.51) ; v1(138.35,56.09) 138.35,55.51 v1(229.9,55.51) ; v1(234.21,58.25) v1(240.31,58.25)
COL9: length 172.1
  Top Layer w0.127: S43.1 S33.1 170.93,23.95 167.02,27.85 167.02,38.13 S21.1 161.39,43.77 161.39,49.57 157.4,53.56 S9.1
  Top Layer w0.203: v1(237.77,60.79) 232.31,60.79 232.31,56.09 v1(228.88,56.09) ; v1(240.31,60.79) 255.3,60.79 255.65,61.14 255.65,61.99 v1(257.84,61.99)
  Bottom Layer w0.203: U100.6 257.91,62.06 v1(257.84,61.99) ; v1(157.4,56.09) v1(228.88,56.09) ; v1(237.77,60.79) v1(240.31,60.79)
COL10: length 145.1
  Top Layer w0.127: S44.1 S34.1 186.04,28.64 186.04,38.17 S22.1 176.45,47.76 S10.1
  Top Layer w0.203: R109.1 v1(242.85,29.04) ; v1(238.79,2.24) v1(238.79,29.04) ; S44.1 v1(190.74,2.24)
  Bottom Layer w0.203: v1(190.74,2.24) v1(238.79,2.24) ; v1(242.85,29.04) U100.22 v1(238.79,29.04)
COL11: length 104.1
  Top Layer w0.127: S45.1 S35.1 209.13,23.95 205.27,27.8 205.27,37.99 S23.1 195.5,47.76 S11.1
  Top Layer w0.203: v1(205.27,39.07) 205.27,36.53 ; v1(235.99,38.82) 236.5,38.31 237.77,38.31 237.77,36.66 v1(238.4,36.66) ; 237.27,36.66 R110.1 ; v1(214.91,39.07) v1(217.96,39.07)
  Bottom Layer w0.203: v1(235.99,38.82) 235.8,39.01 218.02,39.01 v1(217.96,39.07) ; v1(205.27,39.07) v1(214.91,39.07) ; v1(238.4,36.66) U100.25
COL12: length 83.6
  Top Layer w0.127: S12.1 221.69,45.38 S24.1 224.07,28.71 S36.1 S46.1
  Top Layer w0.203: 224.07,39.58 v1(231.42,39.58) ; v1(238.4,46.33) 237.06,46.33 237.06,45.73 v1(236.5,45.17)
  Bottom Layer w0.203: v1(231.42,39.58) 236.5,39.58 v1(236.5,45.17) ; v1(238.4,46.33) 238.89,46.82 U100.29
ENC_A: length 66.4
  Top Layer w0.203: v1(257.84,46.82) 258.21,46.82 258.21,45.22 C105.2
  Bottom Layer w0.203: 250.96,4.08 252.66,2.37 263.42,2.37 264.44,3.39 264.44,46.31 263.93,46.82 U100.12 v1(257.84,46.82)
ENC_B: length 50.6
  Top Layer w0.203: C104.2 258.21,40.14 258.21,41.74 v1(257.84,41.74)
  Bottom Layer w0.203: 256.04,4.08 260.43,4.08 263.42,7.07 263.42,41.23 262.92,41.74 U100.14 v1(257.84,41.74)
ENC_SW: length 40.1
  Top Layer w0.203: v1(246.66,20.79) 241.83,20.79 240.06,22.56 v1(240.06,42.88) ; 243.93,40.09 243.98,40.14 243.98,41.74 v1(244.17,41.74) 244.17,42.38
  Bottom Layer w0.203: v1(240.06,42.88) 240.06,42.59 U100.27 v1(244.17,41.74) ; v1(246.66,20.79) 248.75,20.79 SW100.D
I2S_BCLK: length 42.7
  Top Layer w0.203: U104.5 253.77,42.12 253.77,44.15 250.22,47.71 241.19,47.71 241.19,28.67 v1(243.36,26.5)
  Bottom Layer w0.203: U100.21 v1(243.36,26.5)
I2S_BCLK_5V: length 12.5
  Top Layer w0.203: v1(248.06,35.01) U103.3 ; U104.6 v1(250.47,43.39)
  Bottom Layer w0.203: v1(248.06,35.01) 250.47,37.42 v1(250.47,43.39)
I2S_SD: length 13.3
  Top Layer w0.203: v1(244.63,38.82) 244.75,38.95 244.75,43.39 U104.9
  Bottom Layer w0.203: v1(244.63,38.82) 244.63,36.15 242.6,34.12 U100.24
I2S_SD_5V: length 13.4
  Top Layer w0.203: U104.8 v1(247.68,44.66) ; v1(246.79,35.01) U103.4
  Bottom Layer w0.203: v1(247.68,44.66) 246.79,43.77 v1(246.79,35.01)
I2S_WS: length 11.6
  Top Layer w0.203: 250.47,38.31 v1(251.74,38.31)
  Bottom Layer w0.203: v1(251.74,38.31) 255.93,34.12 U100.17
I2S_WS_5V: length 9.3
  Top Layer w0.203: U103.2 252.96,36.73 252.96,39.58 U104.3
LED1_2: length 16.2
  Bottom Layer w0.127: LED0.2 16.2,14.1 LED1.4
LED1_4: length 13.8
  Bottom Layer w0.127: LED2.4 37.64,14.1 LED1.2
LED2_4: length 13.8
  Bottom Layer w0.127: LED2.2 56.69,14.1 LED3.4
LED3_4: length 27.7
  Bottom Layer w0.127: LED3.2 76.56,17.93 95.52,17.93 LED4.4
LED4_4: length 39.6
  Bottom Layer w0.127: LED4.2 107.53,17.94 138.37,17.94 LED5.4
LED5_4: length 27.7
  Bottom Layer w0.127: LED6.4 165.79,14.1 161.97,17.93 150.38,17.93 LED5.2
LED6_4: length 13.8
  Bottom Layer w0.127: LED7.4 180.51,14.1 LED6.2
LED7_4: length 13.8
  Bottom Layer w0.127: 198.06,15.6 199.56,14.1 LED8.4
LED8_4: length 13.8
  Bottom Layer w0.127: LED8.2 218.61,14.1 LED9.4
LED9_4: length 249.9
  Bottom Layer w0.127: LED10.4 13.07,33.7 9.61,33.7 7.65,31.74 7.65,20.33 9.37,18.61 162.62,18.61 163.11,18.12 235.31,18.12 236.16,17.27 LED9.2
LED10_4: length 21
  Bottom Layer w0.127: LED11.4 20.97,33.15 LED10.2
LED11_4: length 13.8
  Bottom Layer w0.127: LED12.4 47.16,33.15 LED11.2
LED12_4: length 13.8
  Bottom Layer w0.127: LED13.4 66.21,33.15 LED12.2
LED13_4: length 13.8
  Bottom Layer w0.127: LED13.2 85.26,33.15 LED14.4
LED14_4: length 13.3
  Bottom Layer w0.127: 115.51,33.15 104.31,33.15 102.81,34.65
LED15_4: length 14.3
  Bottom Layer w0.127: LED15.2 122.86,33.15 LED16.4
LED16_4: length 13.8
  Bottom Layer w0.127: LED17.4 142.41,33.15 LED16.2
LED17_4: length 13.8
  Bottom Layer w0.127: LED18.4 161.46,33.15 159.96,34.65
LED18_4: length 13.8
  Bottom Layer w0.127: LED19.4 180.51,33.15 LED18.2
LED19_4: length 13.8
  Bottom Layer w0.127: LED20.4 199.56,33.15 198.06,34.65
LED20_4: length 13.8
  Bottom Layer w0.127: LED20.2 218.61,33.15 LED21.4
LED21_4: length 249.1
  Bottom Layer w0.127: LED22.4 6.77,52.2 5.36,50.79 5.36,38.81 6.95,37.21 61.67,37.21 61.72,37.17 62.59,37.17 62.64,37.21 234.47,37.21 236.16,35.53 LED21.2
LED22_4: length 16.2
  Bottom Layer w0.127: LED23.4 16.2,52.2 LED22.2
LED23_4: length 13.8
  Bottom Layer w0.127: LED23.2 37.64,52.2 LED24.4
LED24_4: length 13.8
  Bottom Layer w0.127: LED24.2 56.69,52.2 LED25.4
LED25_4: length 13.8
  Bottom Layer w0.127: LED26.4 75.74,52.2 LED25.2
LED26_4: length 14.6
  Bottom Layer w0.127: LED26.2 94.79,52.2 LED27.4
LED27_4: length 13
  Bottom Layer w0.127: LED27.2 114.64,52.2 LED28.4
LED28_4: length 13.8
  Bottom Layer w0.127: LED28.2 132.89,52.2 LED29.4
LED29_4: length 13.8
  Bottom Layer w0.127: LED30.4 151.94,52.2 LED29.2
LED30_4: length 13.8
  Bottom Layer w0.127: LED30.2 170.99,52.2 LED31.4
LED31_4: length 13.8
  Bottom Layer w0.127: LED31.2 190.04,52.2 LED32.4
LED32_4: length 18.6
  Bottom Layer w0.127: LED32.2 209.09,52.2 LED33.4
LED33_4: length 245.1
  Bottom Layer w0.127: LED33.2 231.4,55.25 230,56.65 18.83,56.65 18.76,56.57 17.88,56.57 17.8,56.65 6.64,56.65 3.19,60.1 3.19,69.22 5.2,71.24 6.46,71.24 LED34.4
LED34_4: length 13.8
  Bottom Layer w0.127: LED34.2 13.82,71.25 LED35.4
LED35_4: length 13.8
  Bottom Layer w0.127: LED36.4 32.87,71.25 LED35.2
LED36_4: length 13.8
  Bottom Layer w0.127: LED36.2 51.92,71.25 LED37.4
LED37_4: length 13.8
  Bottom Layer w0.127: LED38.4 70.97,71.25 LED37.2
LED38_4: length 13.8
  Bottom Layer w0.127: LED38.2 90.02,71.25 LED39.4
LED39_4: length 13.8
  Bottom Layer w0.127: LED39.2 109.07,71.25 LED40.4
LED40_4: length 13.8
  Bottom Layer w0.127: LED41.4 128.12,71.25 LED40.2
LED41_4: length 13.8
  Bottom Layer w0.127: LED42.4 147.17,71.25 LED41.2
LED42_4: length 13.8
  Bottom Layer w0.127: LED43.4 166.22,71.25 LED42.2
LED43_4: length 13.9
  Bottom Layer w0.127: LED43.2 184.11,72.75 185.66,71.21 196.92,71.21 LED44.4
LED44_4: length 21
  Bottom Layer w0.127: LED44.2 203.59,72.75 205.09,71.25 LED45.4
OLED_SCL: length 12.7
  Top Layer w0.203: R114.1 v1(257.84,27.38)
  Bottom Layer w0.203: v1(257.84,27.38) 256.95,26.5 ; 256.95,26.5 U100.20 ; 256.95,26.5 256.06,26.5 J100.3
OLED_SDA: length 17.1
  Top Layer w0.203: J100.4 255.8,23.71 255.8,27.52 v1(257.33,29.04) 257.84,28.53 262.15,28.53 R115.1
  Bottom Layer w0.203: U100.19 v1(257.33,29.04)
RGB: length 4.7
  Bottom Layer w0.203: 229.02,72.76 230,72.76 230.91,71.84 230.91,70.78 231.91,69.78
RGB_BUFFER_OUT: length 60.3
  Top Layer w0.203: v1(233.71,69.78) 233.73,69.76 236,69.76 237.05,70.81 237.05,74.74 237.5,75.2 250.03,75.2 v1(250.34,74.89) ; U104.11 v1(249.5,40.85)
  Bottom Layer w0.203: 250.34,66.28 249.3,65.24 249.3,41.06 v1(249.5,40.85) ; 250.34,66.28 250.34,66.18 ; 250.34,66.28 v1(250.34,74.89) ; v1(233.71,69.78) 234.72,69.78
RGB_MCU: length 47.6
  Top Layer w0.203: v1(254.91,69.3) 254.17,70.05 251.49,70.05 ; v1(249.96,45.5) 249.89,45.42 v1(249.89,41.74) ; U104.12 v1(249.89,39.58) ; v1(249.96,50.25) 249.96,51.9 250.47,52.41 v1(253.77,52.41)
  Bottom Layer w0.203: 254.91,52.41 255.42,51.9 U100.10 ; 254.91,52.41 v1(253.77,52.41) ; 254.91,52.41 v1(254.91,69.3) ; v1(249.96,45.5) v1(249.96,50.25) ; v1(249.89,41.74) 250.09,41.54 250.09,39.79 v1(249.89,39.58)
RGB_POWER_EN: length 42.8
  Top Layer w0.203: v1(238.28,39.2) 239.04,39.96 239.04,70.82 239.8,71.59 242.3,71.59 243.54,70.35 245.16,70.35 245.57,70.75 245.57,71.45 U102.3
  Bottom Layer w0.203: U100.26 v1(238.28,39.2)
ROW1: length 230.2
  Bottom Layer w0.203: D2.3 56.58,57.49 ; 56.58,57.49 18.32,57.49 D1.3 ; 56.58,57.49 94.81,57.49 ; D3.3 94.81,57.49 ; 94.81,57.49 133.09,57.49 ; 133.09,57.49 171.67,57.49 ; 133.09,57.49 133.09,58.19 ; 171.67,57.49 171.67,58.5 ; 171.67,57.49 212.03,57.49 ; U100.31 236.5,51.9 236.5,54.95 233.96,57.49 212.03,57.49 ; 212.03,58.46 212.03,57.49
ROW2: length 238.6
  Top Layer w0.203: v1(234.47,38.44) 234.21,38.69 234.21,51.01 235.74,52.54 v1(237.64,52.54)
  Bottom Layer w0.203: D10.3 137.62,37.6 ; 137.62,37.6 99.67,37.6 ; 137.62,37.6 176.26,37.6 ; 62.16,37.6 22.3,37.6 D7.3 ; 62.16,37.6 99.67,37.6 ; 62.16,37.6 D8.3 ; v1(234.47,38.44) 233.63,37.6 216.25,37.6 ; 99.67,37.6 D9.3 ; 216.25,37.6 D12.3 ; 216.25,37.6 176.26,37.6 ; U100.32 238.66,54.44 238.02,53.81 238.02,52.92 v1(237.64,52.54) ; 176.26,37.6 176.26,38.58
ROW3: length 260
  Top Layer w0.203: v1(233.2,59.52) 233.2,38.31 238.02,33.49 238.02,21.85 236.25,20.08 v1(236.25,19.12)
  Bottom Layer w0.203: 184.78,19.14 223.12,19.14 ; 184.78,19.14 D17.3 ; 184.78,19.14 146.87,19.14 ; 223.12,19.14 223.14,19.12 v1(236.25,19.12) ; 223.12,19.14 223.12,19.52 ; 69.42,19.14 108.47,19.14 ; 69.42,19.14 69.42,19.6 ; 69.42,19.14 29.64,19.14 29.64,19.75 ; 108.47,19.14 108.47,19.73 ; 108.47,19.14 146.87,19.14 ; D16.3 146.87,19.14 ; v1(233.2,59.52) U100.34
ROW4: length 292.2
  Top Layer w0.203: v1(241.83,1.1) 241.83,16.21 242.85,17.23 260.76,17.23 v1(262.03,18.5) ; v1(262.03,21.29) 262.03,22.06 259.11,22.06 258.09,21.04 253.14,21.04 253.14,26.37 v1(255.55,28.79) ; v1(255.55,31.2) 255.55,36.03 v1(256.18,36.66)
  Bottom Layer w0.203: v1(255.55,28.79) v1(255.55,31.2) ; 123.63,1.68 123.63,1.1 ; 123.63,1.1 60.3,1.1 ; 123.63,1.1 185.12,1.1 ; 60.3,1.1 21.15,1.1 21.15,1.37 ; 60.3,1.1 60.3,1.36 ; 223.27,1.1 v1(241.83,1.1) ; 223.27,1.1 185.12,1.1 ; 223.27,1.1 D23.3 ; v1(256.18,36.66) U100.16 ; 185.12,1.1 D22.3 ; v1(262.03,18.5) v1(262.03,21.29)
S1_2: length 5.8
  Bottom Layer w0.127: S1.2 13.09,59.91 D1.1
S2_2: length 12.2
  Bottom Layer w0.127: S2.2 29.96,59.91 19.27,59.91
S3_2: length 5.7
  Bottom Layer w0.127: S3.2 50.44,60.66 D2.1
S4_2: length 13.5
  Bottom Layer w0.127: D2.2 57.53,60.18 58.78,58.93 67.08,58.93 S4.2
S5_2: length 6
  Bottom Layer w0.127: D3.1 89.13,60.07 S5.2
S6_2: length 11.9
  Bottom Layer w0.127: S6.2 106.32,60.07 D3.2
S7_2: length 6
  Bottom Layer w0.127: D4.1 126.6,60.69 S7.2
S8_2: length 12.6
  Bottom Layer w0.127: S8.2 143.85,59.5 134.85,59.5 134.04,60.32 D4.2
S9_2: length 6.3
  Bottom Layer w0.127: D5.1 164.4,61 S9.2
S10_2: length 11.7
  Bottom Layer w0.127: D5.2 173.16,61 174.22,59.94 182.39,59.94 S10.2
S11_2: length 8.6
  Bottom Layer w0.127: S11.2 202.54,60.96 D6.1
S12_2: length 16.5
  Bottom Layer w0.127: S12.2 227.7,60 213.94,60 D6.2
S13_2: length 7.2
  Bottom Layer w0.127: S13.2 14.88,41.45 D7.1
S14_2: length 12.8
  Bottom Layer w0.127: S14.2 35.31,41.45 23.25,41.45
S15_2: length 6.9
  Bottom Layer w0.127: S15.2 56.3,40.51 D8.1
S16_2: length 11.4
  Bottom Layer w0.127: D8.2 72.47,40.51 S16.2
S17_2: length 6.3
  Bottom Layer w0.127: S17.2 94.15,40.76 D9.1
S18_2: length 11.9
  Bottom Layer w0.127: S18.2 110.82,40.76 100.62,40.76
S19_2: length 6.2
  Bottom Layer w0.127: S19.2 132.4,40.61 D10.1
S20_2: length 12.1
  Bottom Layer w0.127: S20.2 148.77,40.61 D10.2
S21_2: length 6.5
  Bottom Layer w0.127: D11.1 170.03,41.08 S21.2
S22_2: length 11.4
  Bottom Layer w0.127: D11.2 187.34,41.08 S22.2
S23_2: length 8.4
  Bottom Layer w0.127: D12.1 208.19,41.02 S23.2
S24_2: length 14.3
  Bottom Layer w0.127: S24.2 230.14,41.02 D12.2
S25_2: length 9.8
  Bottom Layer w0.127: D13.1 19.79,22.25 S25.2
S26_2: length 15
  Bottom Layer w0.127: D13.2 44.69,22.25 S26.2
S27_2: length 4.5
  Bottom Layer w0.127: 68.5,21.84 65.45,21.84 S27.2
S28_2: length 13.5
  Bottom Layer w0.127: 70.39,21.84 82.37,21.84 S28.2
S29_2: length 5.4
  Bottom Layer w0.127: S29.2 103.34,22.04 107.56,22.04
S30_2: length 12.4
  Bottom Layer w0.127: 109.46,22.04 120.68,22.04 S30.2
S31_2: length 5.8
  Bottom Layer w0.127: 145.94,21.91 141.58,21.91 S31.2
S32_2: length 12.2
  Bottom Layer w0.127: S32.2 158.64,21.91 147.84,21.91
S33_2: length 6.3
  Bottom Layer w0.127: D17.1 183.59,21.43 179.41,21.43 178.69,22.16 S33.2
S34_2: length 12.7
  Bottom Layer w0.127: S34.2 196.32,21.48 185.92,21.48 D17.2
S35_2: length 5.8
  Bottom Layer w0.127: S35.2 217.66,22.02 D18.1
S36_2: length 12.1
  Bottom Layer w0.127: D18.2 234.96,22.02 S36.2
S37_2: length 5.8
  Bottom Layer w0.127: S37.2 20.18,3.85 D19.1
S38_2: length 14.4
  Bottom Layer w0.127: D19.2 22.94,3.03 34.99,3.03 S38.2
S39_2: length 4.5
  Bottom Layer w0.127: D20.1 59.34,3.85 S39.2
S40_2: length 13.8
  Bottom Layer w0.127: D20.2 61.25,3.7 62.4,2.55 72.61,2.55 S40.2
S41_2: length 18.8
  Bottom Layer w0.127: S41.2 105.92,2.79 121.29,2.79 D21.1
S42_2: length 23.9
  Bottom Layer w0.127: D21.2 125.6,3.15 147.03,3.15 S42.2
S43_2: length 5.5
  Bottom Layer w0.127: S43.2 178.69,3.84 184.17,3.84
S44_2: length 12.9
  Bottom Layer w0.127: 186.07,3.84 186.07,3.05 186.26,2.86 196.75,2.86 S44.2
S45_2: length 5.7
  Bottom Layer w0.127: D23.1 217.09,3.54 S45.2
S46_2: length 12.4
  Bottom Layer w0.127: D23.2 225.04,2.71 234.7,2.71 S46.2
SPK_N: length 24.2
  Top Layer w0.305: U103.5 246.79,28.28
  Bottom Layer w0.305: v1(246.79,27.9) 257.07,27.9 257.33,28.15 258.34,28.15 258.6,27.9 262.92,27.9 262.92,23.33 J101.2
SPK_P: length 17.2
  Top Layer w0.406: U103.8 v1(250.6,26.5)
  Bottom Layer w0.406: v1(250.6,26.5) 250.6,20.28 260.12,20.28 J101.1

## Copper pours and planes (outline as drawn; the poured copper is in the pictures)
GND on Top Layer: 0.38,74.47 0.4,74.69 0.46,74.91 0.55,75.12 0.68,75.3 0.84,75.46 1.03,75.59 1.23,75.69 1.45,75.75 1.68,75.77 263.43,75.77 263.65,75.75 263.87,75.69 264.08,75.59 264.26,75.46 264.42,75.3 264.55,75.12 264.65,74.91 264.7,74.69 264.72,74.47 264.72,1.88 264.7,1.65 264.65,1.43 264.55,1.23 264.42,1.04 264.26,0.88 264.08,0.76 263.87,0.66 263.65,0.6 263.43,0.58 1.68,0.58 1.45,0.6 1.23,0.66 1.03,0.76 0.84,0.88 0.68,1.04 0.55,1.23 0.46,1.43 0.4,1.65 0.38,1.88
GND on Bottom Layer: 0.38,74.47 0.4,74.69 0.46,74.91 0.55,75.12 0.68,75.3 0.84,75.46 1.03,75.59 1.23,75.69 1.45,75.75 1.68,75.77 263.43,75.77 263.65,75.75 263.87,75.69 264.08,75.59 264.26,75.46 264.42,75.3 264.55,75.12 264.65,74.91 264.7,74.69 264.72,74.47 264.72,1.88 264.7,1.65 264.65,1.43 264.55,1.23 264.42,1.04 264.26,0.88 264.08,0.76 263.87,0.66 263.65,0.6 263.43,0.58 1.68,0.58 1.45,0.6 1.23,0.66 1.03,0.76 0.84,0.88 0.68,1.04 0.55,1.23 0.46,1.43 0.4,1.65 0.38,1.88
VCC on Top Layer: 247.15,73.56 249.65,73.56 249.65,70.62 247.15,70.62

Small or netless copper shapes (teardrops, artwork), in the pictures only: 1 on Bottom Layer
